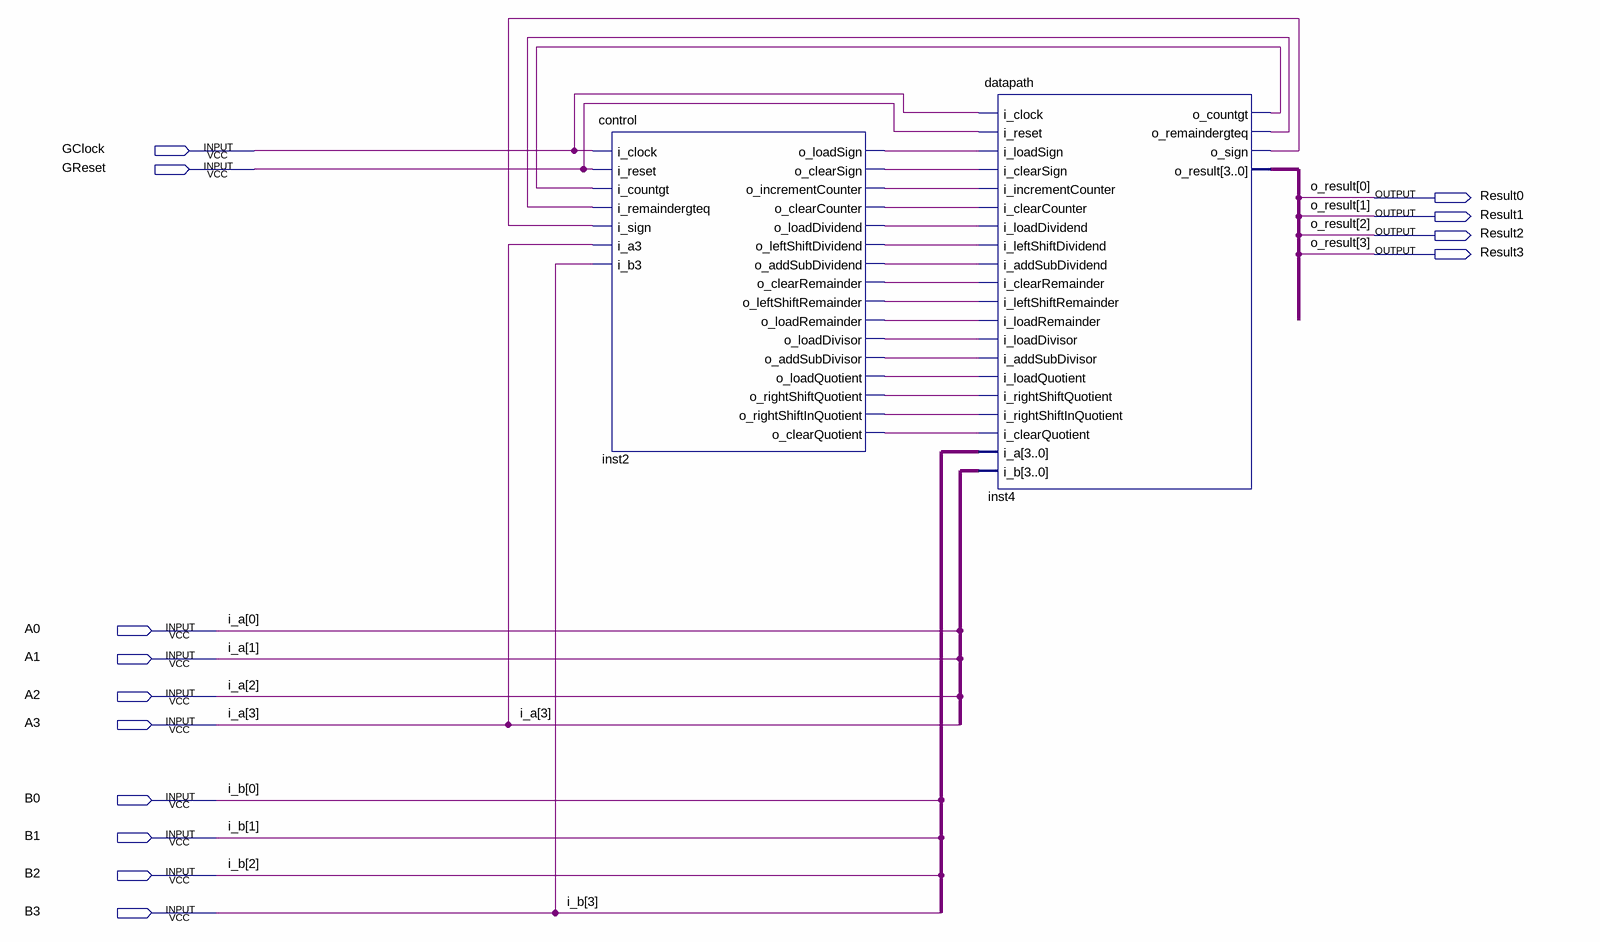
[diagram p0: schematic sheet]
// Quartus schematic Divider.bdf as structural Verilog: 2 symbols, 14 pins
module Divider (
  input  GClock,
  input  GReset,
  input  A0,
  input  A1,
  input  A2,
  input  A3,
  input  B0,
  input  B1,
  input  B2,
  input  B3,
  output Result0,
  output Result1,
  output Result2,
  output Result3
);

  wire inst2_o_addsubdividend, inst2_o_addsubdivisor, inst2_o_clearcounter, inst2_o_clearquotient,
       inst2_o_clearremainder, inst2_o_clearsign, inst2_o_incrementcounter, inst2_o_leftshiftdividend,
       inst2_o_leftshiftremainder, inst2_o_loaddividend, inst2_o_loaddivisor, inst2_o_loadquotient,
       inst2_o_loadremainder, inst2_o_loadsign, inst2_o_rightshiftinquotient, inst2_o_rightshiftquotient,
       inst4_o_countgt, inst4_o_remaindergteq, inst4_o_sign;
  wire [3:0] inst4_o_result, undriven, undriven_2;

  control inst2 (
    .i_clock(GClock), .i_reset(GReset), .i_countgt(inst4_o_countgt), .i_remaindergteq(inst4_o_remaindergteq),
    .i_sign(inst4_o_sign), .i_a3(A3), .i_b3(B3), .o_loadSign(inst2_o_loadsign),
    .o_clearSign(inst2_o_clearsign), .o_incrementCounter(inst2_o_incrementcounter),
    .o_clearCounter(inst2_o_clearcounter), .o_loadDividend(inst2_o_loaddividend),
    .o_leftShiftDividend(inst2_o_leftshiftdividend), .o_addSubDividend(inst2_o_addsubdividend),
    .o_clearRemainder(inst2_o_clearremainder), .o_leftShiftRemainder(inst2_o_leftshiftremainder),
    .o_loadRemainder(inst2_o_loadremainder), .o_loadDivisor(inst2_o_loaddivisor),
    .o_addSubDivisor(inst2_o_addsubdivisor), .o_loadQuotient(inst2_o_loadquotient),
    .o_rightShiftQuotient(inst2_o_rightshiftquotient), .o_rightShiftInQuotient(inst2_o_rightshiftinquotient),
    .o_clearQuotient(inst2_o_clearquotient));
  datapath inst4 (
    .i_clock(GClock), .i_reset(GReset), .i_loadSign(inst2_o_loadsign), .i_clearSign(inst2_o_clearsign),
    .i_incrementCounter(inst2_o_incrementcounter), .i_clearCounter(inst2_o_clearcounter),
    .i_loadDividend(inst2_o_loaddividend), .i_leftShiftDividend(inst2_o_leftshiftdividend),
    .i_addSubDividend(inst2_o_addsubdividend), .i_clearRemainder(inst2_o_clearremainder),
    .i_leftShiftRemainder(inst2_o_leftshiftremainder), .i_loadRemainder(inst2_o_loadremainder),
    .i_loadDivisor(inst2_o_loaddivisor), .i_addSubDivisor(inst2_o_addsubdivisor),
    .i_loadQuotient(inst2_o_loadquotient), .i_rightShiftQuotient(inst2_o_rightshiftquotient),
    .i_rightShiftInQuotient(inst2_o_rightshiftinquotient), .i_clearQuotient(inst2_o_clearquotient),
    .i_a(undriven), .i_b(undriven_2), .o_countgt(inst4_o_countgt), .o_remaindergteq(inst4_o_remaindergteq),
    .o_sign(inst4_o_sign), .o_result(inst4_o_result));

  // Other names for the same wires on the sheet: i_b[3:0] = {B3, B2, B1, B0}; i_a[3:0] = {A3, A2, A1, A0};
  //   o_result[3:0] = {Result3, Result2, Result1, Result0}
endmodule
